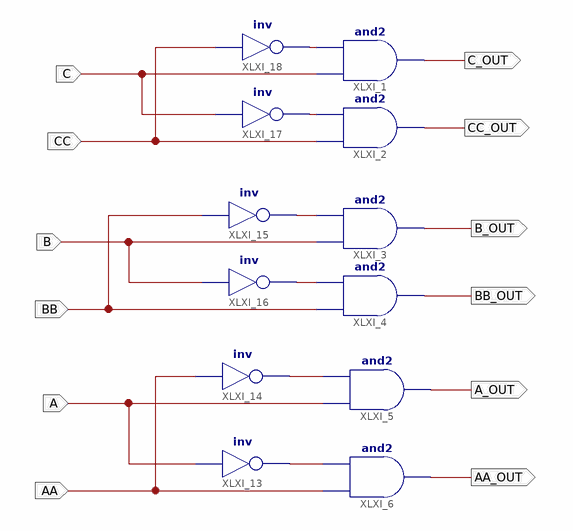
[diagram p0: schematic sheet 1]
// Xilinx ISE schematic DEADTIME.sch (spartan3e) as structural Verilog: 12 symbols, 12 ports
module DEADTIME (
  input  BB,
  input  B,
  input  AA,
  input  A,
  input  CC,
  input  C,
  output C_OUT,
  output CC_OUT,
  output B_OUT,
  output BB_OUT,
  output A_OUT,
  output AA_OUT
);

  wire XLXN_37, XLXN_38, XLXN_39, XLXN_40, XLXN_41, XLXN_42;

  and XLXI_1 (C_OUT, C, XLXN_37);
  and XLXI_2 (CC_OUT, CC, XLXN_38);
  and XLXI_3 (B_OUT, B, XLXN_39);
  and XLXI_4 (BB_OUT, BB, XLXN_40);
  and XLXI_5 (A_OUT, A, XLXN_41);
  and XLXI_6 (AA_OUT, AA, XLXN_42);
  not XLXI_13 (XLXN_42, A);
  not XLXI_14 (XLXN_41, AA);
  not XLXI_15 (XLXN_39, BB);
  not XLXI_16 (XLXN_40, B);
  not XLXI_17 (XLXN_38, C);
  not XLXI_18 (XLXN_37, CC);
endmodule
